# Altium schematic sheet 0_Overview.SchDoc
size A4; SheetNumber: 1; SheetTotal: 7
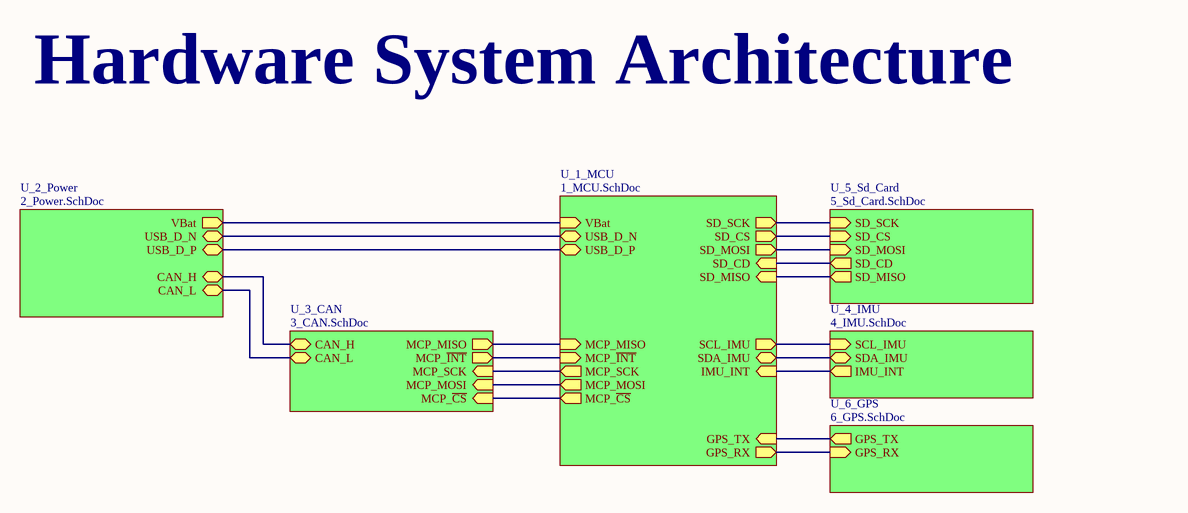
[diagram p0: 0_Overview.SchDoc]

## Sub-sheets
U_1_MCU = 1_MCU.SchDoc: USB_D_N (bidir), USB_D_P (bidir), MCP_SCK (out), MCP_MOSI (out), MCP_MISO (in), MCP_~{INT} (in), MCP_~{CS} (out), SD_SCK (out), SD_CS (out), SD_MOSI (out), SD_MISO (in), GPS_TX (in), GPS_RX (out), SCL_IMU (out), SDA_IMU (bidir), IMU_INT (in), VBat (in), SD_CD (in)
U_2_Power = 2_Power.SchDoc: CAN_L (bidir), CAN_H (bidir), USB_D_P (bidir), USB_D_N (bidir), VBat (out)
U_3_CAN = 3_CAN.SchDoc: CAN_H (bidir), CAN_L (bidir), MCP_SCK (in), MCP_MOSI (in), MCP_MISO (out), MCP_~{INT} (out), MCP_~{CS} (in)
U_4_IMU = 4_IMU.SchDoc: SCL_IMU (in), SDA_IMU (bidir), IMU_INT (out)
U_5_Sd_Card = 5_Sd_Card.SchDoc: SD_SCK (in), SD_CS (in), SD_MOSI (in), SD_MISO (out), SD_CD (out)
U_6_GPS = 6_GPS.SchDoc: GPS_TX (out), GPS_RX (in)

## Nets
(unnamed): sheet U_1_MCU/USB_D_N, sheet U_2_Power/USB_D_N
(unnamed): sheet U_1_MCU/USB_D_P, sheet U_2_Power/USB_D_P
(unnamed): sheet U_1_MCU/MCP_SCK, sheet U_3_CAN/MCP_SCK
(unnamed): sheet U_1_MCU/MCP_MOSI, sheet U_3_CAN/MCP_MOSI
(unnamed): sheet U_1_MCU/MCP_MISO, sheet U_3_CAN/MCP_MISO
(unnamed): sheet U_1_MCU/MCP_~{INT}, sheet U_3_CAN/MCP_~{INT}
(unnamed): sheet U_1_MCU/MCP_~{CS}, sheet U_3_CAN/MCP_~{CS}
(unnamed): sheet U_1_MCU/SD_SCK, sheet U_5_Sd_Card/SD_SCK
(unnamed): sheet U_1_MCU/SD_CS, sheet U_5_Sd_Card/SD_CS
(unnamed): sheet U_1_MCU/SD_MOSI, sheet U_5_Sd_Card/SD_MOSI
(unnamed): sheet U_1_MCU/SD_MISO, sheet U_5_Sd_Card/SD_MISO
(unnamed): sheet U_1_MCU/GPS_TX, sheet U_6_GPS/GPS_TX
(unnamed): sheet U_1_MCU/GPS_RX, sheet U_6_GPS/GPS_RX
(unnamed): sheet U_1_MCU/SCL_IMU, sheet U_4_IMU/SCL_IMU
(unnamed): sheet U_1_MCU/SDA_IMU, sheet U_4_IMU/SDA_IMU
(unnamed): sheet U_1_MCU/IMU_INT, sheet U_4_IMU/IMU_INT
(unnamed): sheet U_1_MCU/VBat, sheet U_2_Power/VBat
(unnamed): sheet U_1_MCU/SD_CD, sheet U_5_Sd_Card/SD_CD
(unnamed): sheet U_2_Power/CAN_L, sheet U_3_CAN/CAN_L
(unnamed): sheet U_2_Power/CAN_H, sheet U_3_CAN/CAN_H

## Notes on the sheet
- Hardware System Architecture